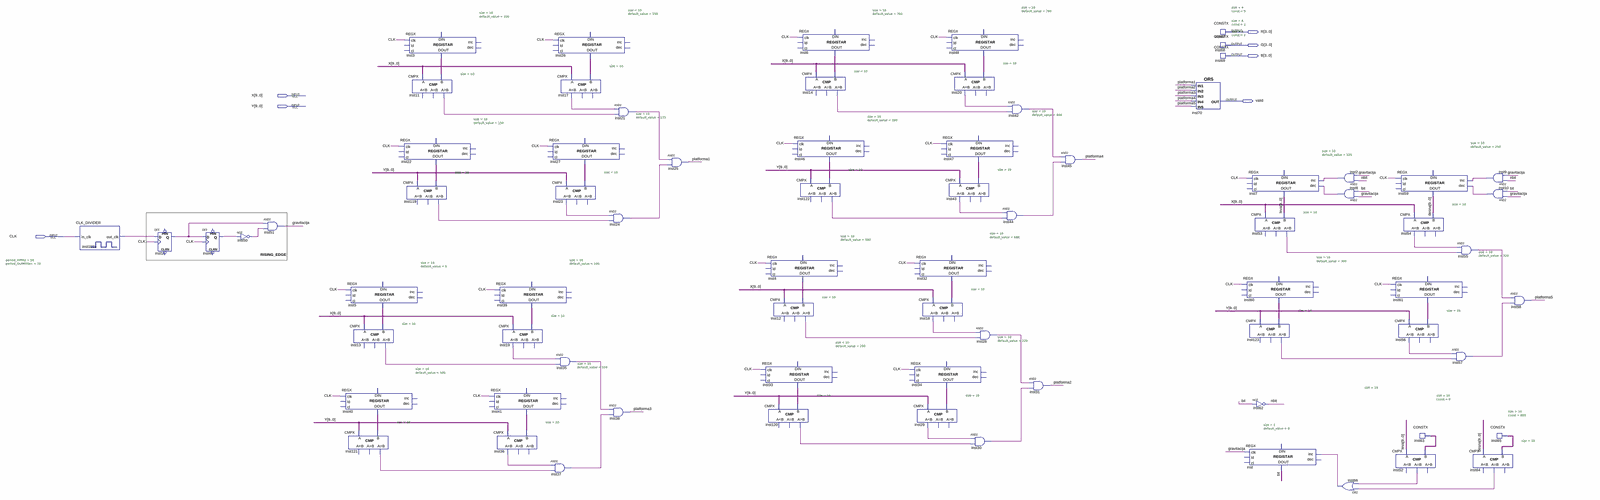
[diagram p0: schematic sheet, whole]
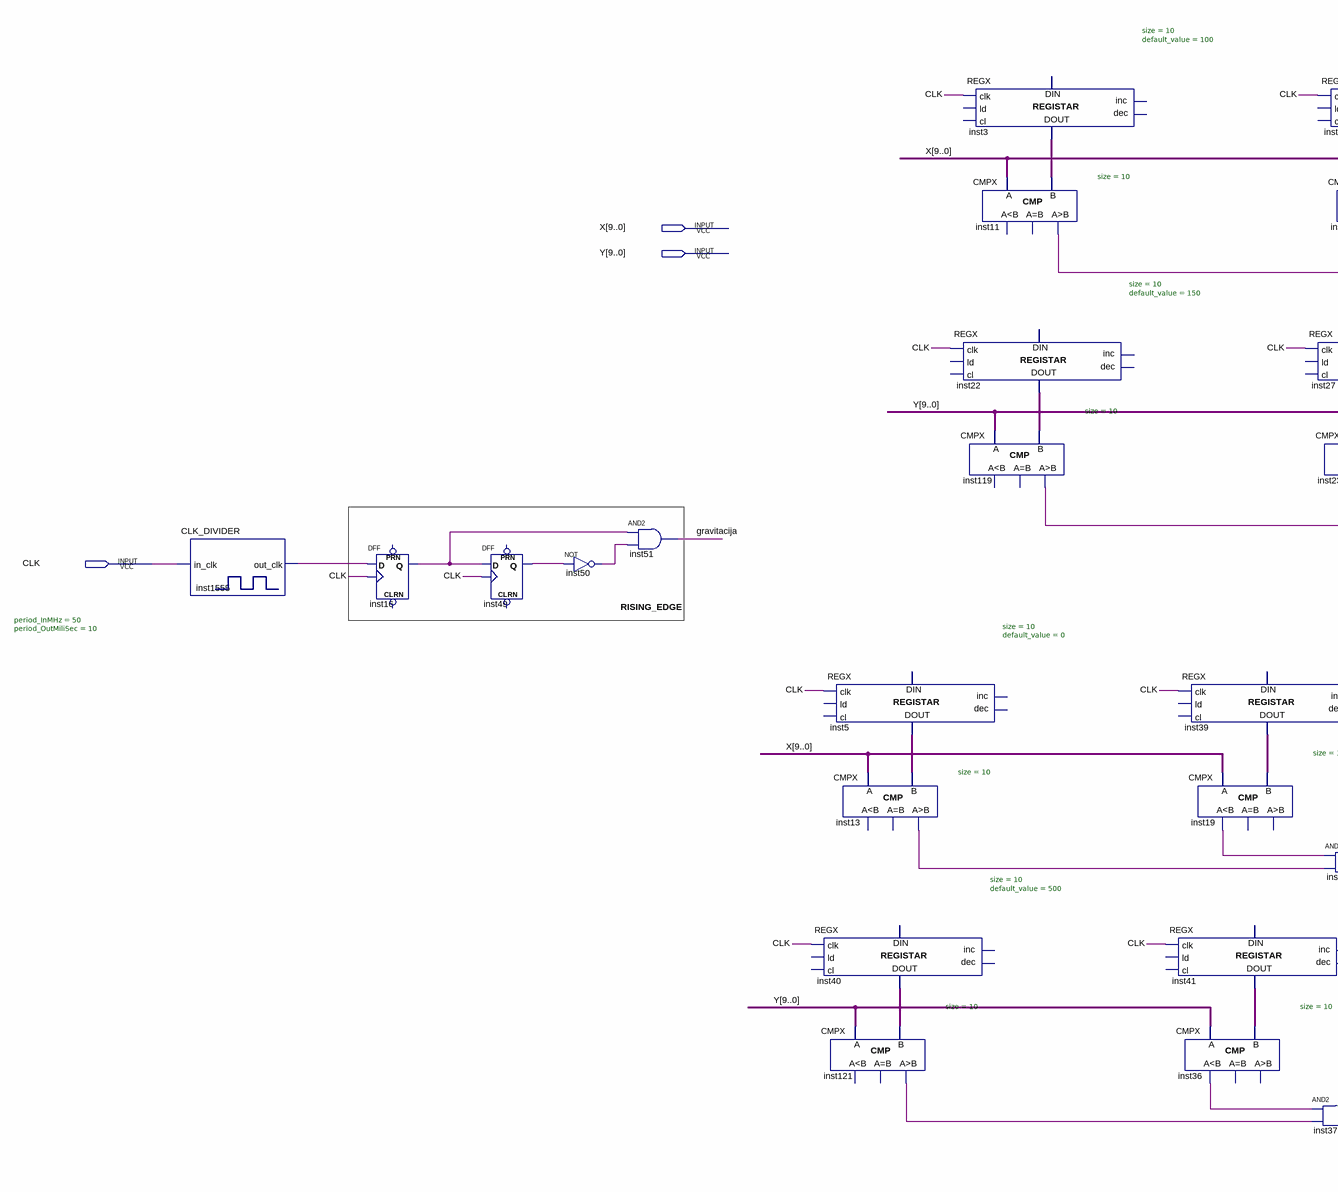
[diagram p1: schematic sheet, left part]
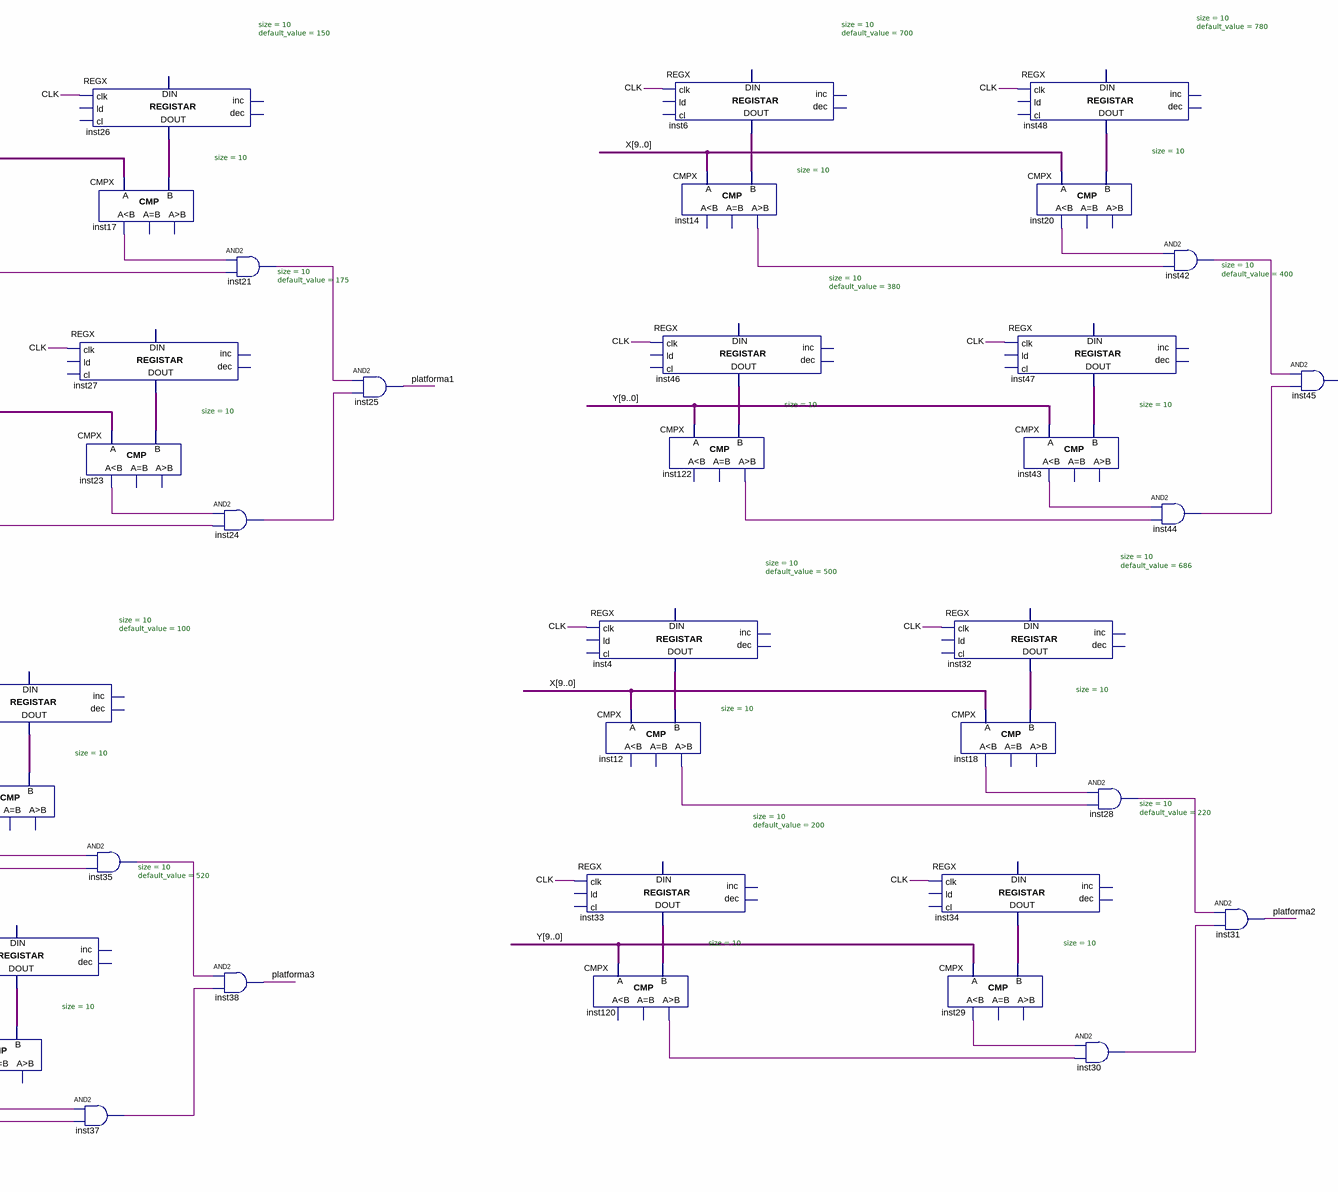
[diagram p2: schematic sheet, centre part]
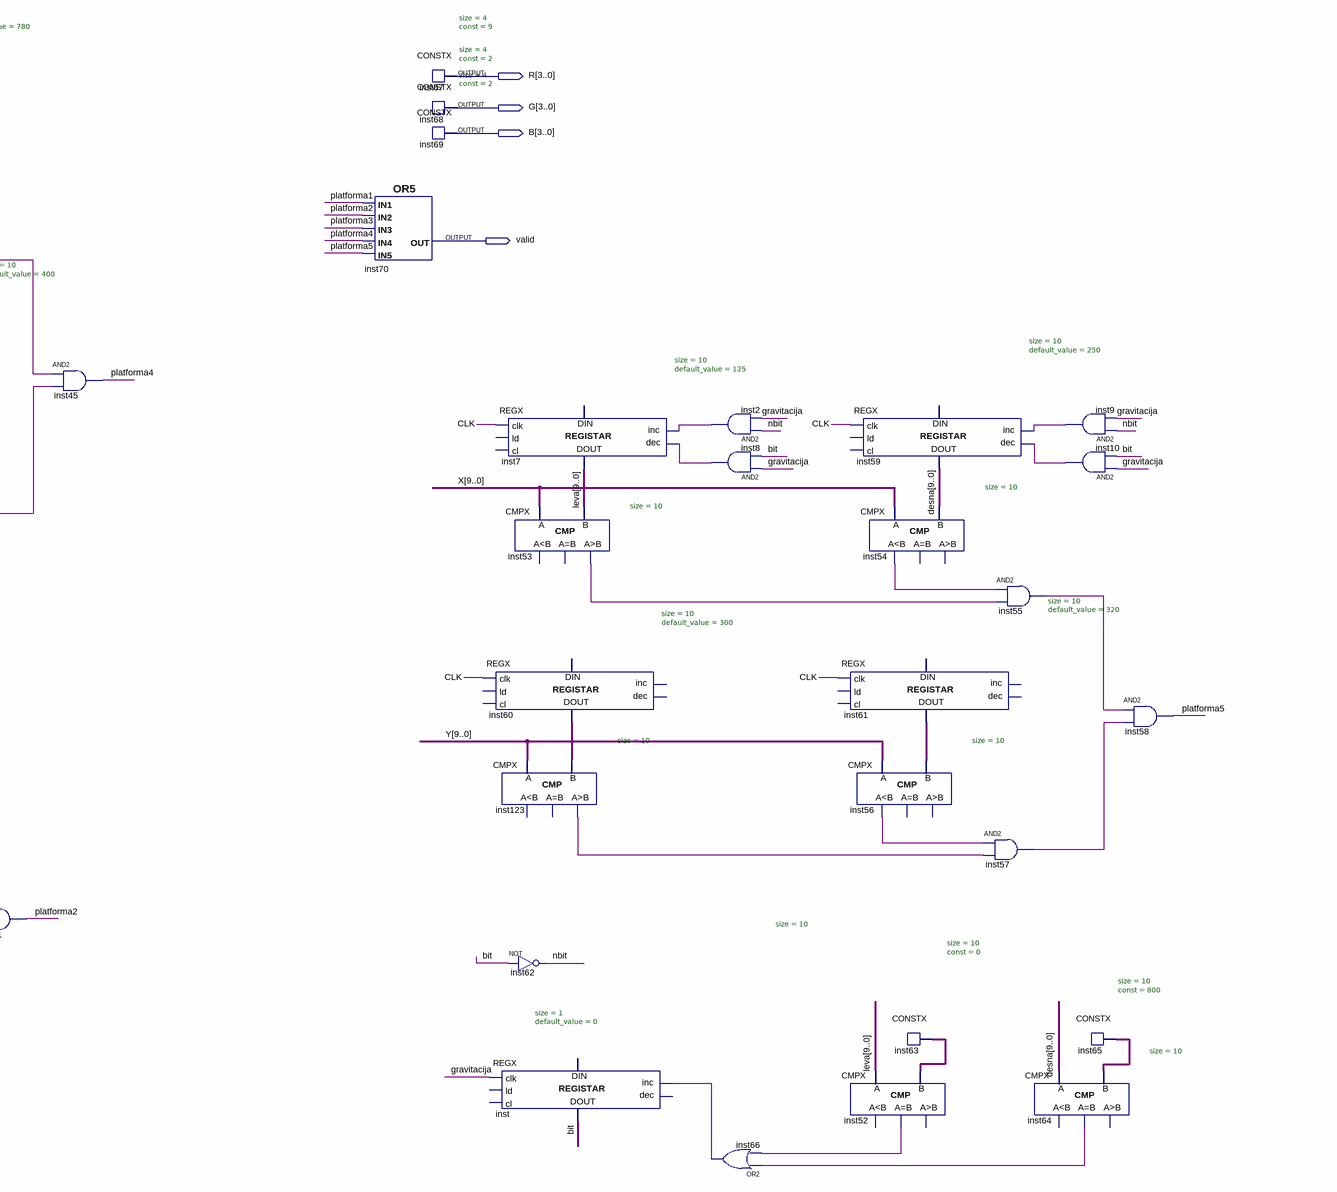
[diagram p3: schematic sheet, right part]
// Quartus schematic platforme.bdf as structural Verilog: 75 symbols, 7 pins
module platforme (
  input  [9:0] X,
  input  [9:0] Y,
  input  CLK,
  output [3:0] R,
  output [3:0] G,
  output [3:0] B,
  output valid
);

  wire \bit , gravitacija, inst2_out, inst8_out, inst9_out, inst10_out, inst11_gr, inst12_gr, inst13_gr,
       inst14_gr, inst16_q, inst17_ls, inst18_ls, inst19_ls, inst20_ls, inst21_out, inst23_ls, inst24_out,
       inst28_out, inst29_ls, inst30_out, inst35_out, inst36_ls, inst37_out, inst42_out, inst43_ls,
       inst44_out, inst49_q, inst50_out, inst52_eq, inst53_gr, inst54_ls, inst55_out, inst56_ls, inst57_out,
       inst64_eq, inst66_out, inst119_gr, inst120_gr, inst121_gr, inst122_gr, inst123_gr, inst1555_out_clk,
       nbit, platforma1, platforma2, platforma3, platforma4, platforma5;
  wire [9:0] desna, inst3_data_out, inst4_data_out, inst5_data_out, inst6_data_out, inst22_data_out,
       inst26_data_out, inst27_data_out, inst32_data_out, inst33_data_out, inst34_data_out, inst39_data_out,
       inst40_data_out, inst41_data_out, inst46_data_out, inst47_data_out, inst48_data_out, inst60_data_out,
       inst61_data_out, inst63_data, inst65_data, leva;

  CLK_DIVIDER #(.period_InMHz(50), .period_OutMiliSec(10)) inst1555 (.in_clk(CLK), .out_clk(inst1555_out_clk));
  DFF inst16 (.CLK(CLK), .D(inst1555_out_clk), .Q(inst16_q));  // open: CLRN, PRN
  DFF inst49 (.CLK(CLK), .D(inst16_q), .Q(inst49_q));  // open: CLRN, PRN
  not inst50 (inst50_out, inst49_q);
  and inst51 (gravitacija, inst16_q, inst50_out);
  REGX #(.size(10), .default_value(500)) inst40 (
    .clk(CLK), .data_out(inst40_data_out));  // open: ld, cl, inc, dec, data_in
  CMPX #(.size(10)) inst121 (.A(Y), .B(inst40_data_out), .gr(inst121_gr));  // open: ls, eq
  REGX #(.size(10), .default_value(0)) inst5 (.clk(CLK), .data_out(inst5_data_out));  // open: ld, cl, inc, dec, data_in
  CMPX #(.size(10)) inst13 (.A(X), .B(inst5_data_out), .gr(inst13_gr));  // open: ls, eq
  REGX #(.size(10), .default_value(100)) inst3 (
    .clk(CLK), .data_out(inst3_data_out));  // open: ld, cl, inc, dec, data_in
  CMPX #(.size(10)) inst11 (.A(X), .B(inst3_data_out), .gr(inst11_gr));  // open: ls, eq
  REGX #(.size(10), .default_value(150)) inst22 (
    .clk(CLK), .data_out(inst22_data_out));  // open: ld, cl, inc, dec, data_in
  CMPX #(.size(10)) inst119 (.A(Y), .B(inst22_data_out), .gr(inst119_gr));  // open: ls, eq
  REGX #(.size(10), .default_value(520)) inst41 (
    .clk(CLK), .data_out(inst41_data_out));  // open: ld, cl, inc, dec, data_in
  CMPX #(.size(10)) inst36 (.A(Y), .B(inst41_data_out), .ls(inst36_ls));  // open: eq, gr
  REGX #(.size(10), .default_value(100)) inst39 (
    .clk(CLK), .data_out(inst39_data_out));  // open: ld, cl, inc, dec, data_in
  CMPX #(.size(10)) inst19 (.A(X), .B(inst39_data_out), .ls(inst19_ls));  // open: eq, gr
  REGX #(.size(10), .default_value(150)) inst26 (
    .clk(CLK), .data_out(inst26_data_out));  // open: ld, cl, inc, dec, data_in
  CMPX #(.size(10)) inst17 (.A(X), .B(inst26_data_out), .ls(inst17_ls));  // open: eq, gr
  REGX #(.size(10), .default_value(175)) inst27 (
    .clk(CLK), .data_out(inst27_data_out));  // open: ld, cl, inc, dec, data_in
  CMPX #(.size(10)) inst23 (.A(Y), .B(inst27_data_out), .ls(inst23_ls));  // open: eq, gr
  and inst35 (inst35_out, inst19_ls, inst13_gr);
  and inst37 (inst37_out, inst36_ls, inst121_gr);
  and inst21 (inst21_out, inst17_ls, inst11_gr);
  and inst24 (inst24_out, inst23_ls, inst119_gr);
  and inst38 (platforma3, inst35_out, inst37_out);
  and inst25 (platforma1, inst21_out, inst24_out);
  REGX #(.size(10), .default_value(500)) inst4 (
    .clk(CLK), .data_out(inst4_data_out));  // open: ld, cl, inc, dec, data_in
  CMPX #(.size(10)) inst12 (.A(X), .B(inst4_data_out), .gr(inst12_gr));  // open: ls, eq
  REGX #(.size(10), .default_value(200)) inst33 (
    .clk(CLK), .data_out(inst33_data_out));  // open: ld, cl, inc, dec, data_in
  CMPX #(.size(10)) inst120 (.A(Y), .B(inst33_data_out), .gr(inst120_gr));  // open: ls, eq
  REGX #(.size(10), .default_value(700)) inst6 (
    .clk(CLK), .data_out(inst6_data_out));  // open: ld, cl, inc, dec, data_in
  CMPX #(.size(10)) inst14 (.A(X), .B(inst6_data_out), .gr(inst14_gr));  // open: ls, eq
  REGX #(.size(10), .default_value(380)) inst46 (
    .clk(CLK), .data_out(inst46_data_out));  // open: ld, cl, inc, dec, data_in
  CMPX #(.size(10)) inst122 (.A(Y), .B(inst46_data_out), .gr(inst122_gr));  // open: ls, eq
  REGX #(.size(10), .default_value(686)) inst32 (
    .clk(CLK), .data_out(inst32_data_out));  // open: ld, cl, inc, dec, data_in
  CMPX #(.size(10)) inst18 (.A(X), .B(inst32_data_out), .ls(inst18_ls));  // open: eq, gr
  REGX #(.size(10), .default_value(220)) inst34 (
    .clk(CLK), .data_out(inst34_data_out));  // open: ld, cl, inc, dec, data_in
  CMPX #(.size(10)) inst29 (.A(Y), .B(inst34_data_out), .ls(inst29_ls));  // open: eq, gr
  REGX #(.size(10), .default_value(780)) inst48 (
    .clk(CLK), .data_out(inst48_data_out));  // open: ld, cl, inc, dec, data_in
  CMPX #(.size(10)) inst20 (.A(X), .B(inst48_data_out), .ls(inst20_ls));  // open: eq, gr
  REGX #(.size(10), .default_value(400)) inst47 (
    .clk(CLK), .data_out(inst47_data_out));  // open: ld, cl, inc, dec, data_in
  CMPX #(.size(10)) inst43 (.A(Y), .B(inst47_data_out), .ls(inst43_ls));  // open: eq, gr
  and inst28 (inst28_out, inst18_ls, inst12_gr);
  and inst30 (inst30_out, inst29_ls, inst120_gr);
  and inst44 (inst44_out, inst43_ls, inst122_gr);
  and inst42 (inst42_out, inst20_ls, inst14_gr);
  and inst31 (platforma2, inst28_out, inst30_out);
  and inst45 (platforma4, inst42_out, inst44_out);
  or inst70 (valid, platforma1, platforma2, platforma3, platforma4, platforma5);
  CONSTX #(.size(4), .\const (9)) inst67 (.data(R));
  CONSTX #(.size(4), .\const (2)) inst68 (.data(G));
  CONSTX #(.size(4), .\const (2)) inst69 (.data(B));
  REGX #(.size(10), .default_value(125)) inst7 (
    .clk(CLK), .inc(inst2_out), .dec(inst8_out), .data_out(leva));  // open: ld, cl, data_in
  CMPX #(.size(10)) inst53 (.A(X), .B(leva), .gr(inst53_gr));  // open: ls, eq
  REGX #(.size(10), .default_value(300)) inst60 (
    .clk(CLK), .data_out(inst60_data_out));  // open: ld, cl, inc, dec, data_in
  CMPX #(.size(10)) inst123 (.A(Y), .B(inst60_data_out), .gr(inst123_gr));  // open: ls, eq
  not inst62 (nbit, \bit );
  REGX #(.size(1), .default_value(0)) inst (
    .clk(gravitacija), .inc(inst66_out), .data_out(\bit ));  // open: ld, cl, dec, data_in
  and inst2 (inst2_out, nbit, gravitacija);
  and inst8 (inst8_out, gravitacija, \bit );
  or inst66 (inst66_out, inst64_eq, inst52_eq);
  REGX #(.size(10), .default_value(250)) inst59 (
    .clk(CLK), .inc(inst9_out), .dec(inst10_out), .data_out(desna));  // open: ld, cl, data_in
  CMPX #(.size(10)) inst54 (.A(X), .B(desna), .ls(inst54_ls));  // open: eq, gr
  REGX #(.size(10), .default_value(320)) inst61 (
    .clk(CLK), .data_out(inst61_data_out));  // open: ld, cl, inc, dec, data_in
  CMPX #(.size(10)) inst56 (.A(Y), .B(inst61_data_out), .ls(inst56_ls));  // open: eq, gr
  CMPX #(.size(10)) inst52 (.A(leva), .B(inst63_data), .eq(inst52_eq));  // open: ls, gr
  CONSTX #(.size(10), .\const (0)) inst63 (.data(inst63_data));
  and inst55 (inst55_out, inst54_ls, inst53_gr);
  and inst57 (inst57_out, inst56_ls, inst123_gr);
  CMPX #(.size(10)) inst64 (.A(desna), .B(inst65_data), .eq(inst64_eq));  // open: ls, gr
  and inst9 (inst9_out, nbit, gravitacija);
  and inst10 (inst10_out, gravitacija, \bit );
  CONSTX #(.size(10), .\const (800)) inst65 (.data(inst65_data));
  and inst58 (platforma5, inst55_out, inst57_out);

  // Notes on the sheet:
  //   RISING_EDGE
endmodule
